# Altium schematic sheet POW.SchDoc
size A4; SheetNumber: 1; SheetTotal: 5
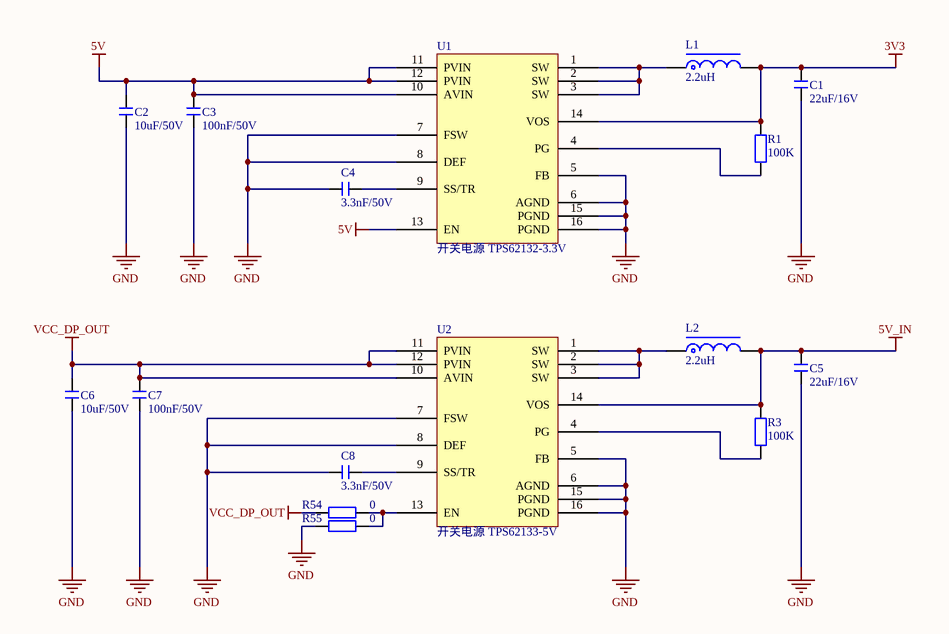
[diagram p0: POW.SchDoc]

## Parts
C1  22uF/16V  [C 0805_L]
C2  10uF/50V  [C 0805_L]
C3  100nF/50V  [C 0603_L]
C4  3.3nF/50V  [C 0402_L]
C5  22uF/16V  [C 0805_L]
C6  10uF/50V  [C 0805_L]
C7  100nF/50V  [C 0603_L]
C8  3.3nF/50V  [C 0402_L]
L1  2.2uH  [电感XFL4020]
L2  2.2uH  [电感XFL4020]
R1  100K  [R 0402_L]
R3  100K  [R 0402_L]
R54  0  [R 0402_L]
R55  0  [R 0402_L]
U1  开关电源 TPS62132-3.3V  [QFN16]
U2  开关电源 TPS62133-5V  [QFN16]

## Nets
3V3: C1.1 L1.2 R1.2 U1.14(VOS)
5V: C2.2 C3.2 U1.10(AVIN) U1.11(PVIN) U1.12(PVIN) U1.13(EN)
5V_IN: C5.1 L2.2 R3.1 U2.14(VOS)
GND: C1.2 C2.1 C3.1 C4.1 C5.2 C6.1 C7.1 C8.1 R55.1 U1.5(FB) U1.6(AGND) U1.7(FSW) U1.8(DEF) U1.15(PGND) U1.16(PGND) U2.5(FB) U2.6(AGND) U2.7(FSW) U2.8(DEF) U2.15(PGND) U2.16(PGND)
VCC_DP_OUT: C6.2 C7.2 R54.1 U2.10(AVIN) U2.11(PVIN) U2.12(PVIN)
NetC4_2: C4.2 U1.9(SS/TR)
NetC8_2: C8.2 U2.9(SS/TR)
NetL1_1: L1.1 U1.1(SW) U1.2(SW) U1.3(SW)
NetL2_1: L2.1 U2.1(SW) U2.2(SW) U2.3(SW)
NetR1_1: R1.1 U1.4(PG)
NetR3_2: R3.2 U2.4(PG)
NetR54_2: R54.2 R55.2 U2.13(EN)

## Library data of the parts
C1 C5 = C: 贴片电容; 主类型: 电容; 值精度: ±10%; 元件封装: 0805; 具体类型: 陶瓷电容; 封装类型: 贴片; 温度漂移: X7R（10%）; 温度范围: -55°C ~ 125°C; 生产商: SAMSUNG(三星); 生产商零件编码: CL21A226KOQNNNE; 值/型号: 22uF/16V; 立创编号: C296720
C2 C6 = C: 贴片电容; 主类型: 电容; 值精度: ±10%; 元件封装: 0805; 具体类型: 陶瓷电容; 封装类型: 贴片; 温度漂移: X5R; 温度范围: -55°C ~ 125°C; 生产商: muRata(村田); 生产商零件编码: GRM21BR61H106KE43L; 值/型号: 10uF/50V; 立创编号: C440198
C3 C7 = C: 贴片电容; 主类型: 电容; 值精度: ±10%; 元件封装: 0603; 具体类型: 陶瓷电容; 封装类型: 贴片; 温度漂移: X7R（15%）; 温度范围: -55°C ~ 125°C; 生产商: SAMSUNG(三星); 生产商零件编码: CL10B104KB8NNNC; 值/型号: 100nF/50V; 立创编号: C1590
C4 C8 = C: 贴片电容; 主类型: 电容; 值精度: ±5%; 元件封装: 0402; 具体类型: 陶瓷电容; 封装类型: 贴片; 温度漂移: X7R（5%）; 温度范围: -55°C ~ 125°C; 生产商: YAGEO(国巨); 生产商零件编码: CC0402JRX7R9BB332; 值/型号: 3.3nF/50V; 立创编号: C541447
L1 L2 = L-CD: XFL4020-222MEB; 主类型: 电感; 元件封装: 4020; 具体类型: 功率电感; 封装类型: 贴片; 温度范围: -40-125; 生产商: Coilcraft; 类型备注: 淘宝采购; 值/型号: XFL4020-222MEB; 生产商零件编码: XFL4020-222MEB; 立创编号: https://detail.tmall.com/item.htm?spm=a230r.1.14.16.717a6f292tX0SR&id=619184428761&ns=1&abbucket=12
R1 R3 = R: 贴片电阻 0402 1%; 主类型: 电阻; 元件封装: 0402; 封装类型: 贴片; 温度漂移: ±100ppm/℃; 生产商: 国巨; 生产商零件编码: RC0402FR-07100KL; 值/型号: 100K; 值精度: ±1%; 具体类型: 贴片电阻; 立创编号: C60491
R54 R55 = R: 贴片电阻; 元件封装: 0402; 封装类型: 贴片
U1 U2 = 开关电源 TPS62133: 主类型: 线性稳压器; 值/型号: TPS62133RGTR; 元件封装: VQFN-16; 具体类型: LDO; 封装类型: 贴片; 温度范围: -40-85; 生产商: TI(德州仪器); 生产商零件编码: TPS62133RGTR; 立创编号: C73973